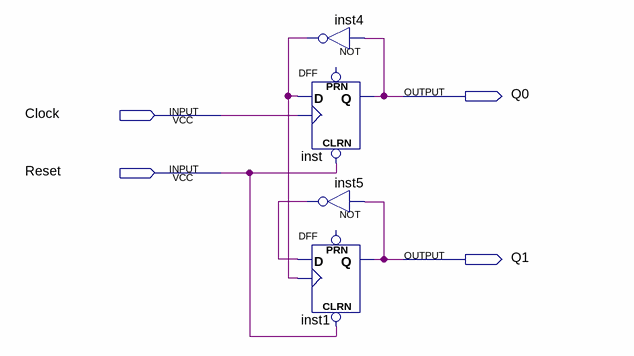
[diagram p0: schematic sheet]
// Quartus schematic Ripple2.bdf as structural Verilog: 4 symbols, 4 pins
module Ripple2 (
  input  Clock,
  input  Reset,
  output Q0,
  output Q1
);

  wire inst4_out, inst5_out;

  not inst4 (inst4_out, Q0);
  DFF inst (.CLRN(Reset), .CLK(Clock), .D(inst4_out), .Q(Q0));  // open: PRN
  not inst5 (inst5_out, Q1);
  DFF inst1 (.CLRN(Reset), .CLK(inst4_out), .D(inst5_out), .Q(Q1));  // open: PRN
endmodule
